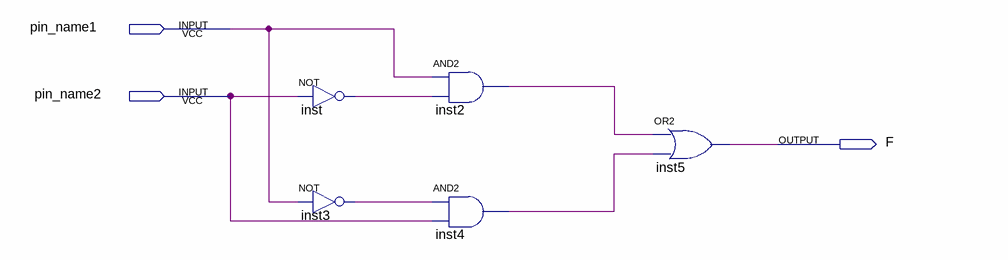
[diagram p0: schematic sheet]
// Quartus schematic Lab0.bdf as structural Verilog: 5 symbols, 3 pins
module Lab0 (
  input  pin_name1,
  input  pin_name2,
  output F
);

  wire inst2_out, inst3_out, inst4_out, inst_out;

  not inst (inst_out, pin_name2);
  not inst3 (inst3_out, pin_name1);
  and inst2 (inst2_out, pin_name1, inst_out);
  and inst4 (inst4_out, inst3_out, pin_name2);
  or inst5 (F, inst2_out, inst4_out);
endmodule
